# Altium schematic sheet sch_smarthome.SchDoc
size A4; SheetNumber: 1; SheetTotal: 1
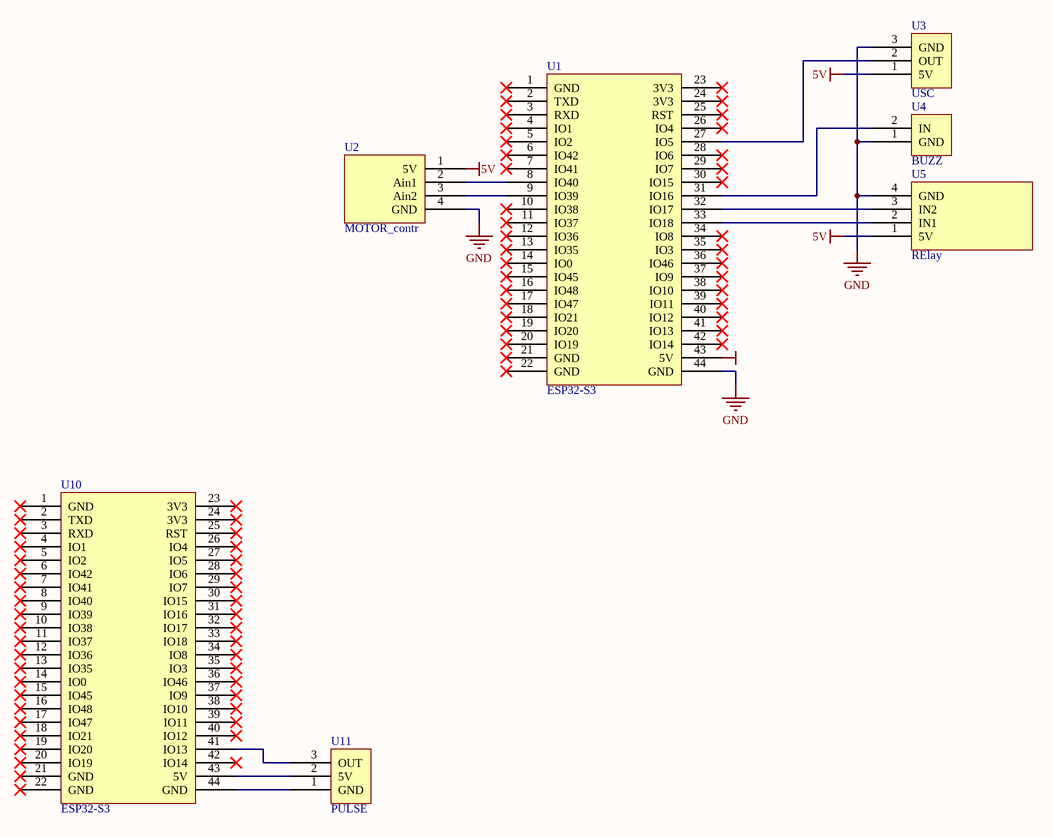
[diagram p0: sch_smarthome.SchDoc]

## Parts
U1  ESP32-S3
U2  MOTOR_contr
U3  USC
U4  BUZZ
U5  RElay
U10  ESP32-S3
U11  PULSE

## Nets
5V: U2.1(5V) U3.1(5V) U5.1(5V)
GND: U1.44(GND) U2.4(GND) U3.3(GND) U4.1(GND) U5.4(GND)
NetU1_8: U1.8(IO40) U2.2(Ain1)
NetU1_9: U1.9(IO39) U2.3(Ain2)
NetU1_27: U1.27(IO5) U3.2(OUT)
NetU1_31: U1.31(IO16) U4.2(IN)
NetU1_32: U1.32(IO17) U5.3(IN2)
NetU1_33: U1.33(IO18) U5.2(IN1)
NetU10_41: U10.41(IO13) U11.3(OUT)
NetU10_43: U10.43(5V) U11.2(5V)
NetU10_44: U10.44(GND) U11.1(GND)

Not connected (* = marked no-connect by the designer): U1 1(GND)* 2(TXD)* 3(RXD)* 4(IO1)* 5(IO2)* 6(IO42)* 7(IO41)* 10(IO38)* 11(IO37)* 12(IO36)* 13(IO35)* 14(IO0)* 15(IO45)* 16(IO48)* 17(IO47)* 18(IO21)* 19(IO20)* 20(IO19)* 21(GND)* 22(GND)* 23(3V3)* 24(3V3)* 25(RST)* 26(IO4)* 28(IO6)* 29(IO7)* 30(IO15)* 34(IO8)* 35(IO3)* 36(IO46)* 37(IO9)* 38(IO10)* 39(IO11)* 40(IO12)* 41(IO13)* 42(IO14)* 43(5V); U10 1(GND)* 2(TXD)* 3(RXD)* 4(IO1)* 5(IO2)* 6(IO42)* 7(IO41)* 8(IO40)* 9(IO39)* 10(IO38)* 11(IO37)* 12(IO36)* 13(IO35)* 14(IO0)* 15(IO45)* 16(IO48)* 17(IO47)* 18(IO21)* 19(IO20)* 20(IO19)* 21(GND)* 22(GND)* 23(3V3)* 24(3V3)* 25(RST)* 26(IO4)* 27(IO5)* 28(IO6)* 29(IO7)* 30(IO15)* 31(IO16)* 32(IO17)* 33(IO18)* 34(IO8)* 35(IO3)* 36(IO46)* 37(IO9)* 38(IO10)* 39(IO11)* 40(IO12)* 42(IO14)*